# Altium schematic sheet SAWS Connection Diagram.SchDoc
size 500 x 500 mm
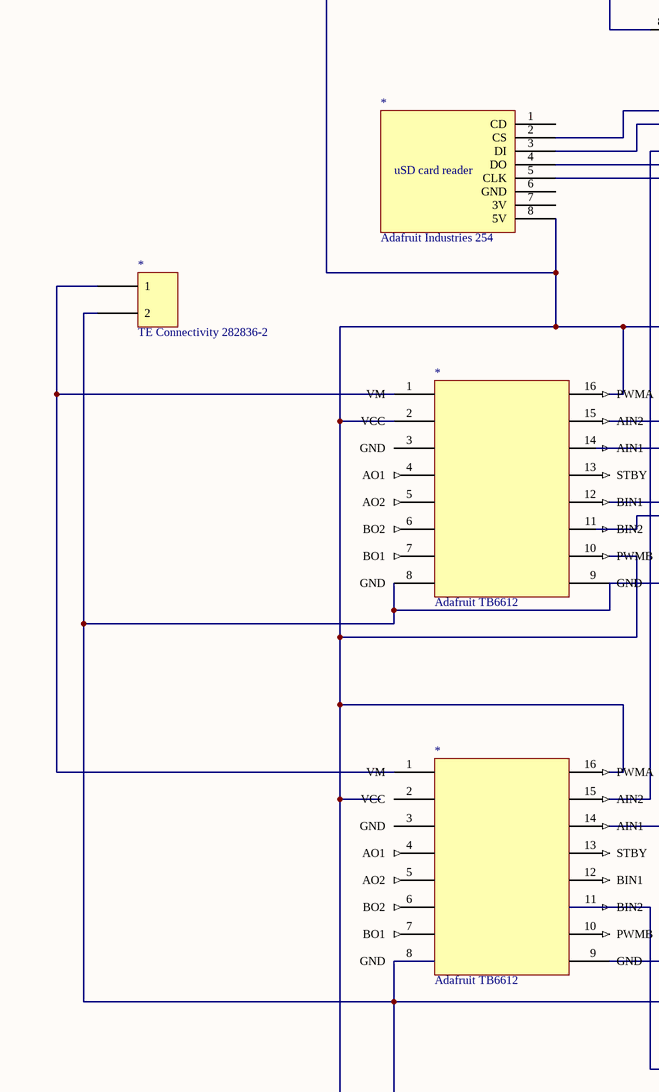
[diagram p0: SAWS Connection Diagram.SchDoc, left]
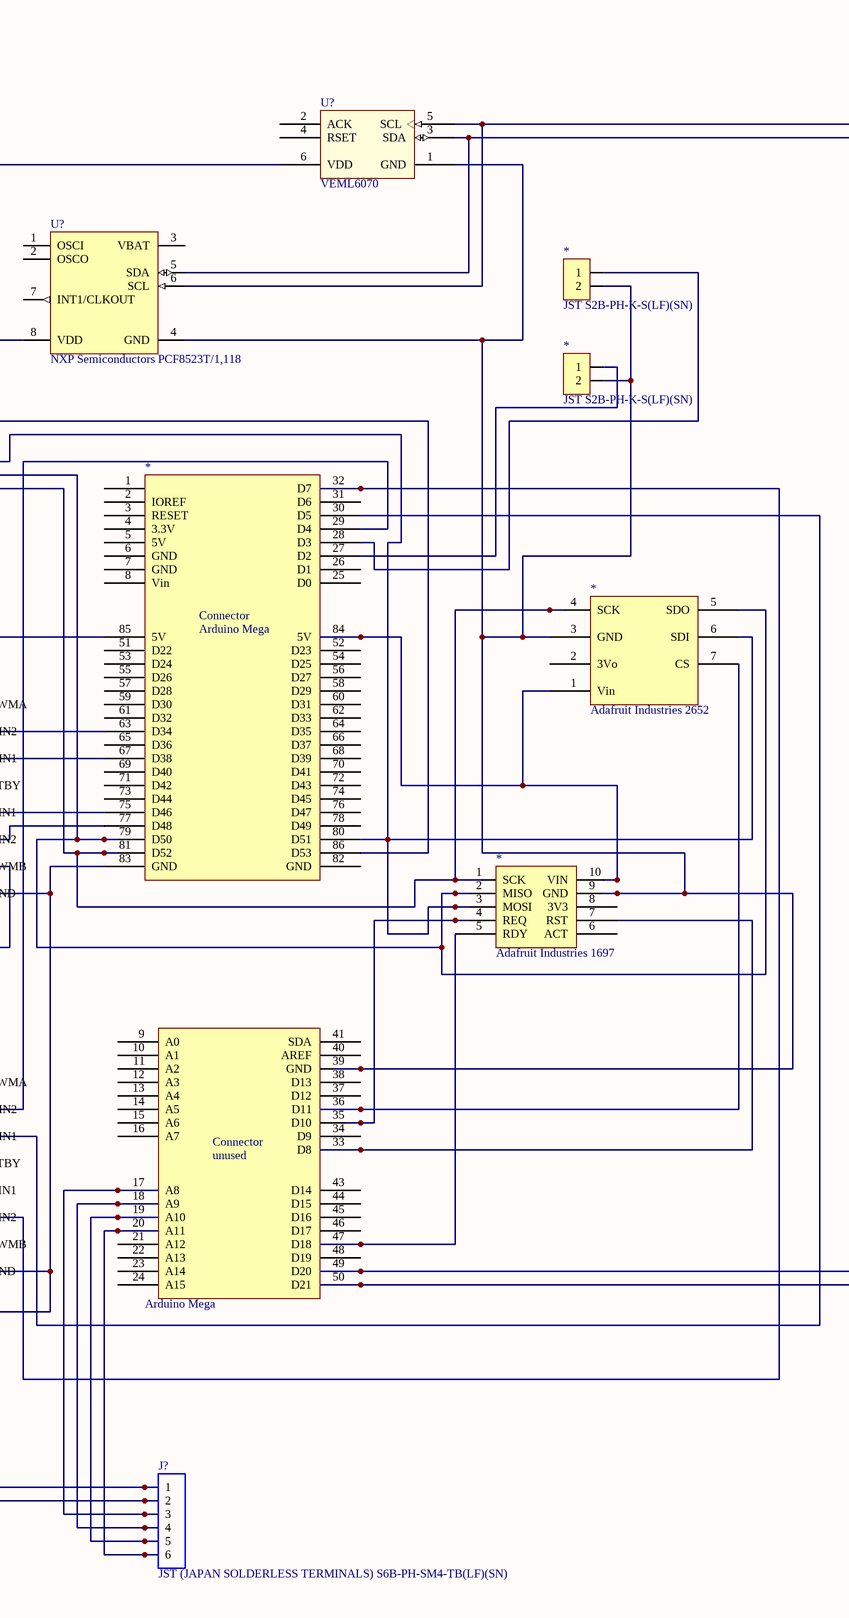
[diagram p1: SAWS Connection Diagram.SchDoc, right]

## Parts
(Parts that share a designator on the sheet are numbered #1, #2 ... from top to bottom, then left to right.)
*#1  JST S2B-PH-K-S(LF)(SN)  [PCBComponent_1 - duplicate]
*#2  JST S2B-PH-K-S(LF)(SN)  [PCBComponent_1 - duplicate]
*#3  Adafruit Industries 254  [PCB-14uusre4tcuerloricup-1]
*#4  TE Connectivity 282836-2  [PCB-0kdx5sneyudsmu18l6zv-1]
*#5  Adafruit Industries 2652  [PCB-8cpanwn2r2nbal49d52i-1]
*#6  Adafruit TB6612  [PCB-i53bh64vexzah4n4868h-1]
*#7  Arduino Mega  [TFT_Shield_MEGA]
*#8  Adafruit Industries 1697  [PCB-jbwx2r95ohr5pnaey095-1]
*#9  Adafruit TB6612  [PCB-i53bh64vexzah4n4868h-1]
J?  JST (JAPAN SOLDERLESS TERMINALS) S6B-PH-SM4-TB(LF)(SN)  [PCB-643062-1]
U?#1  VEML6070  [PCB-p4pozrsuowobialt3zsg-1]
U?#2  NXP Semiconductors PCF8523T/1,118  [PCB-1019860-1]

## Nets
GND: *#6.4(GND) *#6.7(GND) *#9.4(GND) *#9.7(GND)
Net*#1_1: *#1.1 *#7.28(D3)
Net*#1_2: *#1.2 *#2.2 *#5.3(GND) *#7.39(GND) *#8.9(GND) U?#1.1(GND) U?#2.4(GND)
Net*#2_1: *#2.1 *#7.27(D2)
Net*#3_2: *#3.2(CS) *#7.86(D53)
Net*#3_3: *#3.3(DI) *#5.6(SDI) *#7.80(D51) *#8.3(MOSI)
Net*#3_4: *#3.4(DO) *#5.5(SDO) *#7.79(D50) *#8.2(MISO)
Net*#3_5: *#3.5(CLK) *#5.4(SCK) *#7.81(D52) *#8.1(SCK)
Net*#3_8: *#3.8(5V) *#7.85(5V) J?.1 U?#1.6(VDD) U?#2.8(VDD)
Net*#4_2: *#4.2 *#7.83(GND) *#9.8(GND) J?.2
Net*#5_1: *#5.1(Vin) *#7.84(5V) *#8.10(VIN)
Net*#5_7: *#5.7(CS) *#7.36(D11)
Net*#7_17: *#7.17(A8) J?.3
Net*#7_18: *#7.18(A9) J?.4
Net*#7_19: *#7.19(A10) J?.5
Net*#7_20: *#7.20(A11) J?.6
Net*#7_32: *#7.32(D7) *#9.11(BIN2)
Net*#7_33: *#7.33(D8) *#8.7(RST)
Net*#7_35: *#7.35(D10) *#8.4(REQ)
Net*#7_47: *#7.47(D18) *#8.5(RDY)
Net*#7_49: *#7.49(D20) U?#1.3(SDA) U?#2.5(SDA)
Net*#7_50: *#7.50(D21) U?#1.5(SCL) U?#2.6(SCL)

Not connected (* = marked no-connect by the designer): *#3 1(CD) 6(GND) 7(3V); *#4 1; *#5 2(3Vo); *#6 1(VM) 2(VCC) 3(GND) 5(AO2) 6(BO2) 8(GND) 9(GND) 10(PWMB) 11(BIN2) 12(BIN1) 13(STBY) 14(AIN1) 15(AIN2) 16(PWMA); *#7 1 2(IOREF) 3(RESET) 4(3.3V) 5(5V) 6(GND) 7(GND) 8(Vin) 9(A0) 10(A1) 11(A2) 12(A3) 13(A4) 14(A5) 15(A6) 16(A7) 21(A12) 22(A13) 23(A14) 24(A15) 25(D0) 26(D1) 29(D4) 30(D5) 31(D6) 34(D9) 37(D12) 38(D13) 40(AREF) 41(SDA) 43(D14) 44(D15) 45(D16) 46(D17) 48(D19) 51(D22) 52(D23) 53(D24) 54(D25) 55(D26) 56(D27) 57(D28) 58(D29) 59(D30) 60(D31) 61(D32) 62(D33) 63(D34) 64(D35) 65(D36) 66(D37) 67(D38) 68(D39) 69(D40) 70(D41) 71(D42) 72(D43) 73(D44) 74(D45) 75(D46) 76(D47) 77(D48) 78(D49) 82(GND); *#8 6(ACT) 8(3V3); *#9 1(VM) 2(VCC) 3(GND) 5(AO2) 6(BO2) 9(GND) 10(PWMB) 12(BIN1) 13(STBY) 14(AIN1) 15(AIN2) 16(PWMA); U?#1 2(ACK) 4(RSET); U?#2 1(OSCI) 2(OSCO) 3(VBAT) 7(INT1/CLKOUT)

## Notes on the sheet
- (in symbol 254) uSD card reader
- (in symbol ARDUINO MEGA2560 REV3) Connector; unused

## Library data of the parts
*#1 *#2 = S2B-PH-K-S(LF)(SN): JST S2B-PH-K-S (LF)(SN) Multi-pin Connector, Angled Series PH Number of pins: 2 Nominal current: 2 A; Voltage Rating (AC): 100 V; Lead-Free Status: Lead Free; Pin Pitch: 2.00 mm; Number of Contacts: 2; Gender: Male; Insulation Resistance: 1.00 GΩ; Current Rating: 2.00 A; Octopart URL: http://octopart.com/s2b-ph-k-s%28lf%29%28sn%29-jst-248883; Contact Plating: Tin; Housing Material: Nylon; Housing Color: Natural; Contact Material: Brass; REACH SVHC Compliance: No SVHC; Size-Width: 7.60 mm; Manufacturer Part Number: S2B-PH-K-S(LF)(SN); Size-Length: 5.90 mm; Color: White; Number of Rows: 1; Mounting Style: Through Hole; Size-Height: 4.80 mm; Number of Positions: 2; Flammability Rating: UL 94 V-0
*#3 = 254: Roll Pin Punch 5/32 x 4-1/2 Inch Steel - GR0191303; Manufacturer Part Number: 254; OctopartID: d7261fdbc47208e1
*#4 = 282836-2: Wire to Board 2 Position 5 mm Pitch 30-16 AWG Euro Style Terminal Block; Current Rating: 13.5 A; Wire Gauge: 15.0 AWG; Lead-Free Status: Lead Free; Number of Positions: 2; Voltage Rating (AC): 250.0 V; Pin Pitch: 0.005 m; ELV Compliant: Compliant; Housing Material: Nylon 6/6; Flammability Rating: UL 94 V-0; RoHS: Compliant; Insulation Material: Nylon; OctopartID: 369bfdc835bbe95c; Color: Green; Number of Contacts: 2; Lifecycle Status: Active; REACH SVHC Compliance: No SVHC; Contact Plating: Tin; Orientation: Right Angle; Housing Color: Green; Octopart URL: http://octopart.com/282836-2-te+connectivity-39396934; Mounting Style: PCB; Manufacturer Part Number: 282836-2; Contact Material: Brass
*#5 = 2652: Adafruit BME280 I2C or SPI Temperature Humidity Pressure Sensor; Manufacturer Part Number: 2652; RoHS: Compliant; OctopartID: af1f65fc1be270d8; Octopart URL: http://octopart.com/2652-adafruit+industries-65638811
*#6 *#9 = 2448: dual dc motor driver board; Octopart URL: http://octopart.com/2448-adafruit+industries-60760535
*#7 = ARDUINO MEGA2560 REV3: Sainsmart, TFT LCD Mega Shield, V1.0, Arduino Mega 2560; Shop: http://www.sainsmart.com/sainsmart-tft-lcd-adjustable-shield-for-arduino-mega-2560-r3-1280-a082-plug.html; OctopartID: 0ba5c1fab996d462
*#8 = 1697: Micro Jack; Solder Mount Jack; Length .233; Pin Size .022-.032; Brass/Gold; Manufacturer Part Number: 1697; Output Voltage: 40.0 V; Power Rating: 200 W; Size-Width: 193 mm; OctopartID: 792bb2f1ef18a6ec; Size-Length: 215 mm; Size-Height: 98.0 mm; Octopart URL: http://octopart.com/1697-adafruit+industries-47231829
J? = S6B-PH-SM4-TB(LF)(SN): CONN HEADER PH SIDE 6POS 2MM SMD; Current Rating: 2.0 A; Gender: Male; Insulation Resistance: 1000000000.0 Ω; Lead-Free Status: Lead Free; Number of Contacts: 6; Pin Pitch: 0.002 m; Voltage Rating (AC): 100.0 V; Color: White; Contact Material: Brass; Contact Plating: Tin; Flammability Rating: UL 94 V-0; Housing Color: Natural; Housing Material: Nylon; Mounting Style: Surface Mount; Number of Positions: 6; Number of Rows: 1; Octopart Url: https://octopart.com/s6b-ph-sm4-tb%28lf%29%28sn%29-jst-248917; OctopartID: 93375a3e7a044cf0; Packaging: Cut Tape (CT); REACH SVHC Compliance: No SVHC; RoHS: Compliant; Size-Height: 0.0055 m; Size-Length: 0.0159 m; Size-Width: 0.0076 m
U?#1 = CMP-deee14aa07af0129-2: VEML6030 Series 5.5 V 2.35 x 1.8 x 1 mm UV A Light Sensor with I2C Interface; Octopart URL: http://octopart.com/veml6070-vishay-55508007
U?#2 = PCF8523T/1,118: IC RTC/CALENDAR 8SOIC; Lead-Free Status: Lead Free; Lifecycle Status: Active; Number of Pins: 8; Octopart Url: https://octopart.com/pcf8523t%2F1%2C118-nxp+semiconductors-19647991; OctopartID: c7930fb22f021854; Packaging: Cut Tape (CT); REACH SVHC Compliance: No SVHC; RoHS: Compliant